# EAGLE design m913b-breadboard (EAGLE 7.5.1)
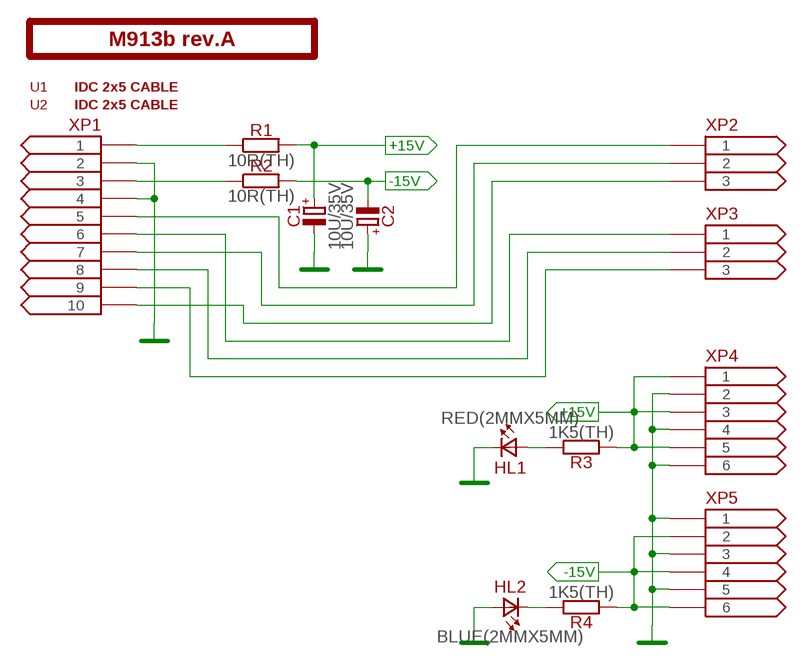
[diagram p0: schematic, sheet 1]

## Parts
C1  10U/35V  [E2-5]
C2  10U/35V  [E2-5]
HL1  RED(2MMX5MM)  [LED2X5]
HL2  BLUE(2MMX5MM)  [LED2X5]
PCB1  M913b rev.A  GENERIC  [EMPTY]
R1  10R(TH)  [R-0207/10]
R2  10R(TH)  [R-0207/10]
R3  1K5(TH)  [R-0207/10]
R4  1K5(TH)  [R-0207/10]
U1  IDC 2x5 CABLE  OTHER  [EMPTY]
U2  IDC 2x5 CABLE  OTHER  [EMPTY]
XP1  CONN-10-IDC  [ML10]
XP2  CONN-3-NORMAL  [MA03-1]
XP3  CONN-3-NORMAL  [MA03-1]
XP4  CONN-6-NORMAL  [MA03-2]
XP5  CONN-6-NORMAL  [MA03-2]

## Nets
+15V: C1.+ R1.2 R3.1 XP4.1 XP4.3 XP4.5
-15V: C2.- R2.2 R4.1 XP5.2 XP5.4 XP5.6
GND: C1.- C2.+ HL1.K(C) HL2.A XP1.2 XP1.4 XP4.2 XP4.4 XP4.6 XP5.1 XP5.3 XP5.5
N$1: HL1.A R3.2
N$2: R1.1 XP1.1
N$3: R2.1 XP1.3
N$4: HL2.K(C) R4.2
N$5: XP1.5 XP2.1
N$6: XP1.7 XP2.2
N$7: XP1.10 XP2.3
N$8: XP1.6 XP3.1
N$9: XP1.8 XP3.2
N$10: XP1.9 XP3.3

## Library data of the parts
C1 C2 = capacitors-electrolytic:?; MOUSER: 647-USW1V100MDD
HL1 HL2 = optoelectronics:?(2MMX5MM)
PCB1 = module-footprints:GENERIC
R1 R2 = resistors:?; MOUSER: 71-RN55D-F-10/R
R3 R4 = resistors:?; MOUSER: 71-CCF071K50GKE36
U1 U2 = hardware:OTHER
XP1 = connectors:CONN-10-?
XP2 XP3 = connectors:CONN-3-?
XP4 XP5 = connectors:CONN-6-?

## Board
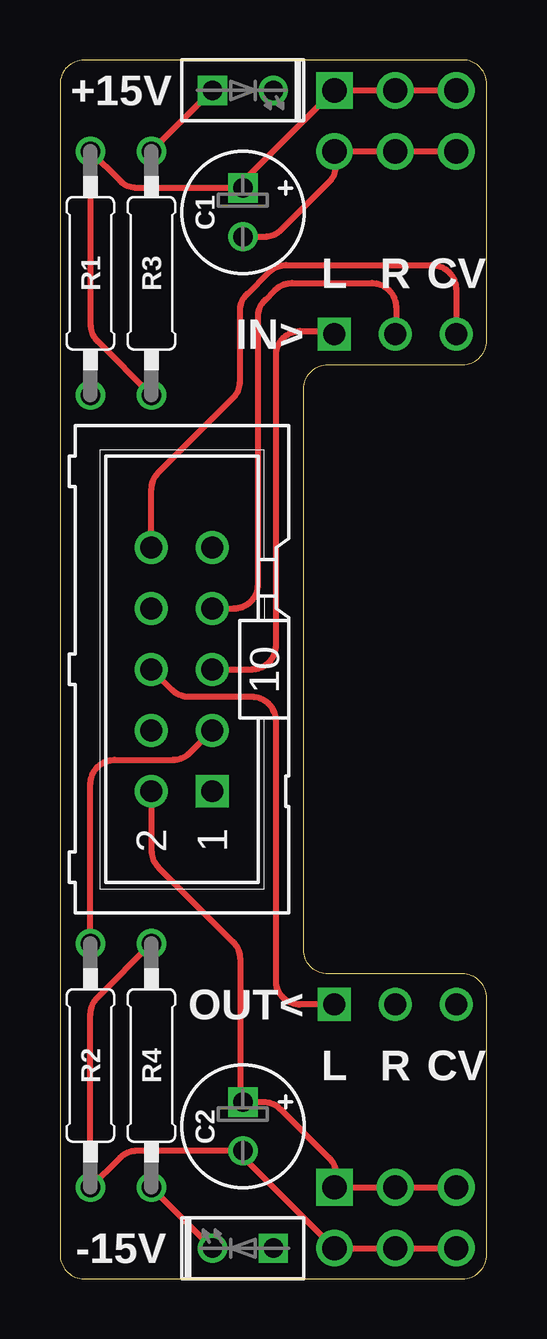
[diagram p1: board, top side]
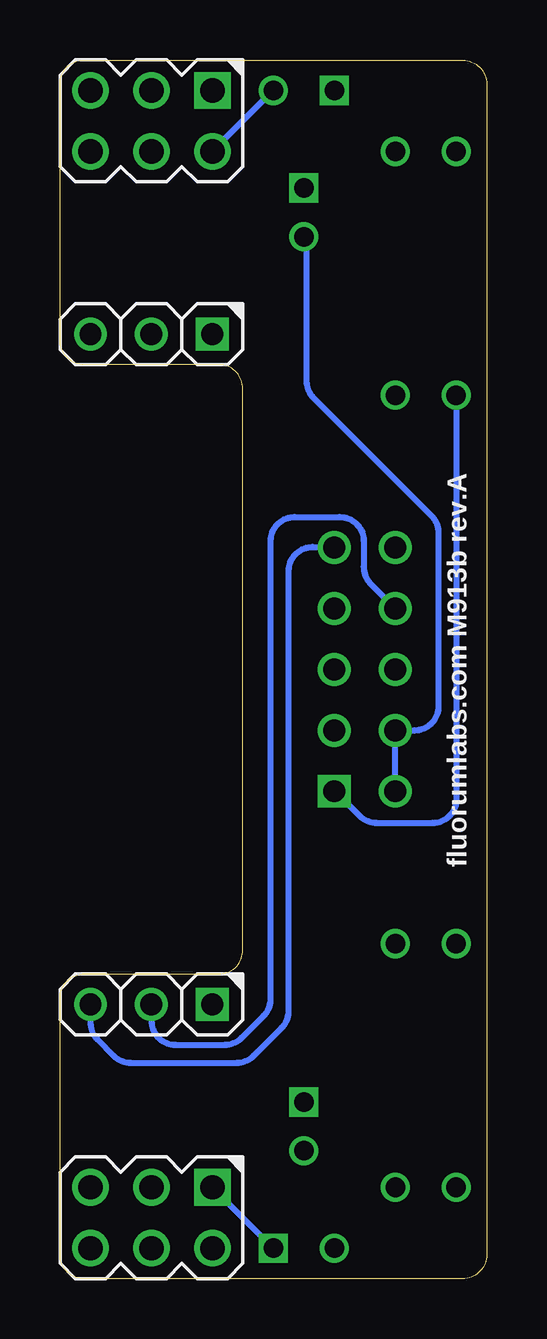
[diagram p2: board, bottom side, seen from below]

Size 17.78 x 50.8 mm. Coordinates in mm from the lower left corner, seen from the top.
Outline: 0,49.79 0,1 arc90 1,0 16.78,0 arc90 17.78,1 17.78,11.7 arc90 16.78,12.7 11.16,12.7 arc-90 10.16,13.7 10.16,37.1 arc-90 11.16,38.1 16.78,38.1 arc90 17.78,39.1 17.78,49.8 arc90 16.78,50.8 1,50.79 arc90 0,49.79
Copper layers (1*16): Top 0.0356mm / dielectric 1.5011mm / Bottom 0.0356mm
Design rules "sonictrain": minimum track width 6mil, minimum drill 13mil, track to track 8mil, track to pad 8mil, pad to pad 6mil, via to via 6mil, smd to smd 6mil, copper to edge 15mil, drill to drill 6mil, minimum pad ring 7mil, minimum via ring 7mil, stop-mask expansion 3mil, vias tented up to drill 25mil, thermal gap 10mil

### Footprints (pad centres in the part's own frame; a part is rotated, then mirrored left to right if it is on the bottom)
E2-5 = drill 0.813 square: + -1.016,0 | drill 0.813: - 1.016,0
LED2X5 = drill 0.813 square: A -1.27,0 | drill 0.813: K 1.27,0
R-0207/10 = drill 0.813: 1 -5.08,0; 2 5.08,0
ML10 = drill 0.914 square: 1 -5.08,-1.27 | drill 0.914: 2 -5.08,1.27; 3 -2.54,-1.27; 4 -2.54,1.27; 5 0,-1.27; 6 0,1.27; 7 2.54,-1.27; 8 2.54,1.27; 9 5.08,-1.27; 10 5.08,1.27
MA03-1 = drill 0.914 square: 1 0,0 | drill 0.914: 2 2.54,0; 3 5.08,0
MA03-2 = drill 1.016 square: 1 -2.54,-1.27 | drill 1.016: 2 -2.54,1.27; 3 0,-1.27; 4 0,1.27; 5 2.54,-1.27; 6 2.54,1.27

### Placement (x,y rotation side)
C1  7.62,44.45 270 top
C2  7.62,6.35 270 top
HL1  7.62,49.53 0 top
HL2  7.62,1.27 180 top
PCB1  0,0 0 top
R1  1.27,41.91 90 top
R2  1.27,8.89 270 top
R3  3.81,41.91 90 top
R4  3.81,8.89 270 top
U1  -1.02,0 0 top
U2  -2.03,0 0 top
XP1  5.08,25.4 90 top
XP2  11.43,39.37 180 bottom
XP3  11.43,11.43 180 bottom
XP4  13.97,48.26 180 bottom
XP5  13.97,2.54 180 bottom

### Tracks (layer width: path | path; a pad name or v marks a point on that pad's centre or on a via)
+15V
  Top 0.254: R3.1 1.56,39.08 arc-45 1.27,39.78 R1.2 2.5,45.76 arc45 3.21,45.47 C1.+ 7.62,45.72 XP4.1 XP4.3 XP4.5
-15V
  Top 0.254: R4.1 1.56,11.72 arc45 1.27,11.02 R2.2 2.5,5.04 arc-45 3.21,5.33 C2.- 7.62,5.08 XP5.2 XP5.4 XP5.6
GND
  Top 0.254: C1.- 8.52,43.43 arc45 9.23,43.73 11.21,45.71 arc45 11.5,46.41 11.5,46.92 XP4.2 XP4.4 XP4.6 | XP5.5 XP5.3 XP5.1 11.5,3.88 11.5,4.34 arc45 11.21,5.04 9.18,7.07 arc45 8.47,7.37 C2.+ 7.5,7.49 7.5,13.34 arc45 7.21,14.04 4.1,17.15 arc-45 3.81,17.85 XP1.2
  Bottom 0.254: HL1.K XP4.2 | HL2.A XP5.1 | C1.- 7.5,43.31 7.5,37.41 arc-45 7.21,36.71 2.29,31.79 arc45 2,31.09 2,23.86 arc90 3,22.86 XP1.4 XP1.2
N$1
  Top 0.254: HL1.A R3.2
N$2
  Bottom 0.254: XP1.1 6.32,20.32 5.29,19.29 arc-45 4.59,19 2.25,19 arc-90 1.25,20 1.25,36.81 R1.1
N$3
  Top 0.254: R2.1 1.27,20.62 arc-90 2.27,21.62 4.7,21.62 arc45 5.41,21.92 XP1.3
N$4
  Top 0.254: R4.2 HL2.K
N$5
  Top 0.254: XP1.5 8,25.4 arc90 9,26.4 9,38.5 arc-90 10,39.5 11.3,39.5 XP2.1
N$6
  Top 0.254: XP1.7 7.25,27.94 arc90 8.25,28.94 8.25,40.09 arc-45 8.54,40.79 8.96,41.21 arc-45 9.66,41.5 13,41.5 arc-90 14,40.5 14,39.4 XP2.2
N$7
  Top 0.254: XP1.10 3.81,32.9 arc-45 4.1,33.6 7.21,36.71 arc45 7.5,37.41 7.5,40.34 arc-45 7.79,41.04 8.71,41.96 arc-45 9.41,42.25 15.5,42.25 arc-90 16.5,41.25 XP2.3
N$8
  Top 0.254: XP3.1 10,11.43 arc-90 9,12.43 9,23.25 arc90 8,24.25 5.37,24.25 arc-45 4.67,24.54 XP1.6
N$9
  Bottom 0.254: XP3.2 13.97,10.75 arc-90 12.97,9.75 10.91,9.75 arc-45 10.21,10.04 9.29,10.96 arc-45 9,11.66 9,30.75 arc90 8,31.75 6.12,31.75 arc90 5.12,30.75 5.12,29.67 arc-45 4.83,28.96 XP1.8
N$10
  Bottom 0.254: XP3.3 16.51,10.67 arc-45 16.22,9.97 15.54,9.29 arc-45 14.84,9 10.41,9 arc-45 9.71,9.29 8.54,10.46 arc-45 8.25,11.16 8.25,29.5 arc90 7.25,30.5 6.37,30.5 XP1.9

### Text on the board
tPlace: +15V | L | R | CV | IN> | OUT< | L | R | CV | -15V
bPlace: fluorumlabs.com M913b rev.A